# EAGLE design Mini Black Pill grblHAL v1 (EAGLE 9.6.2)
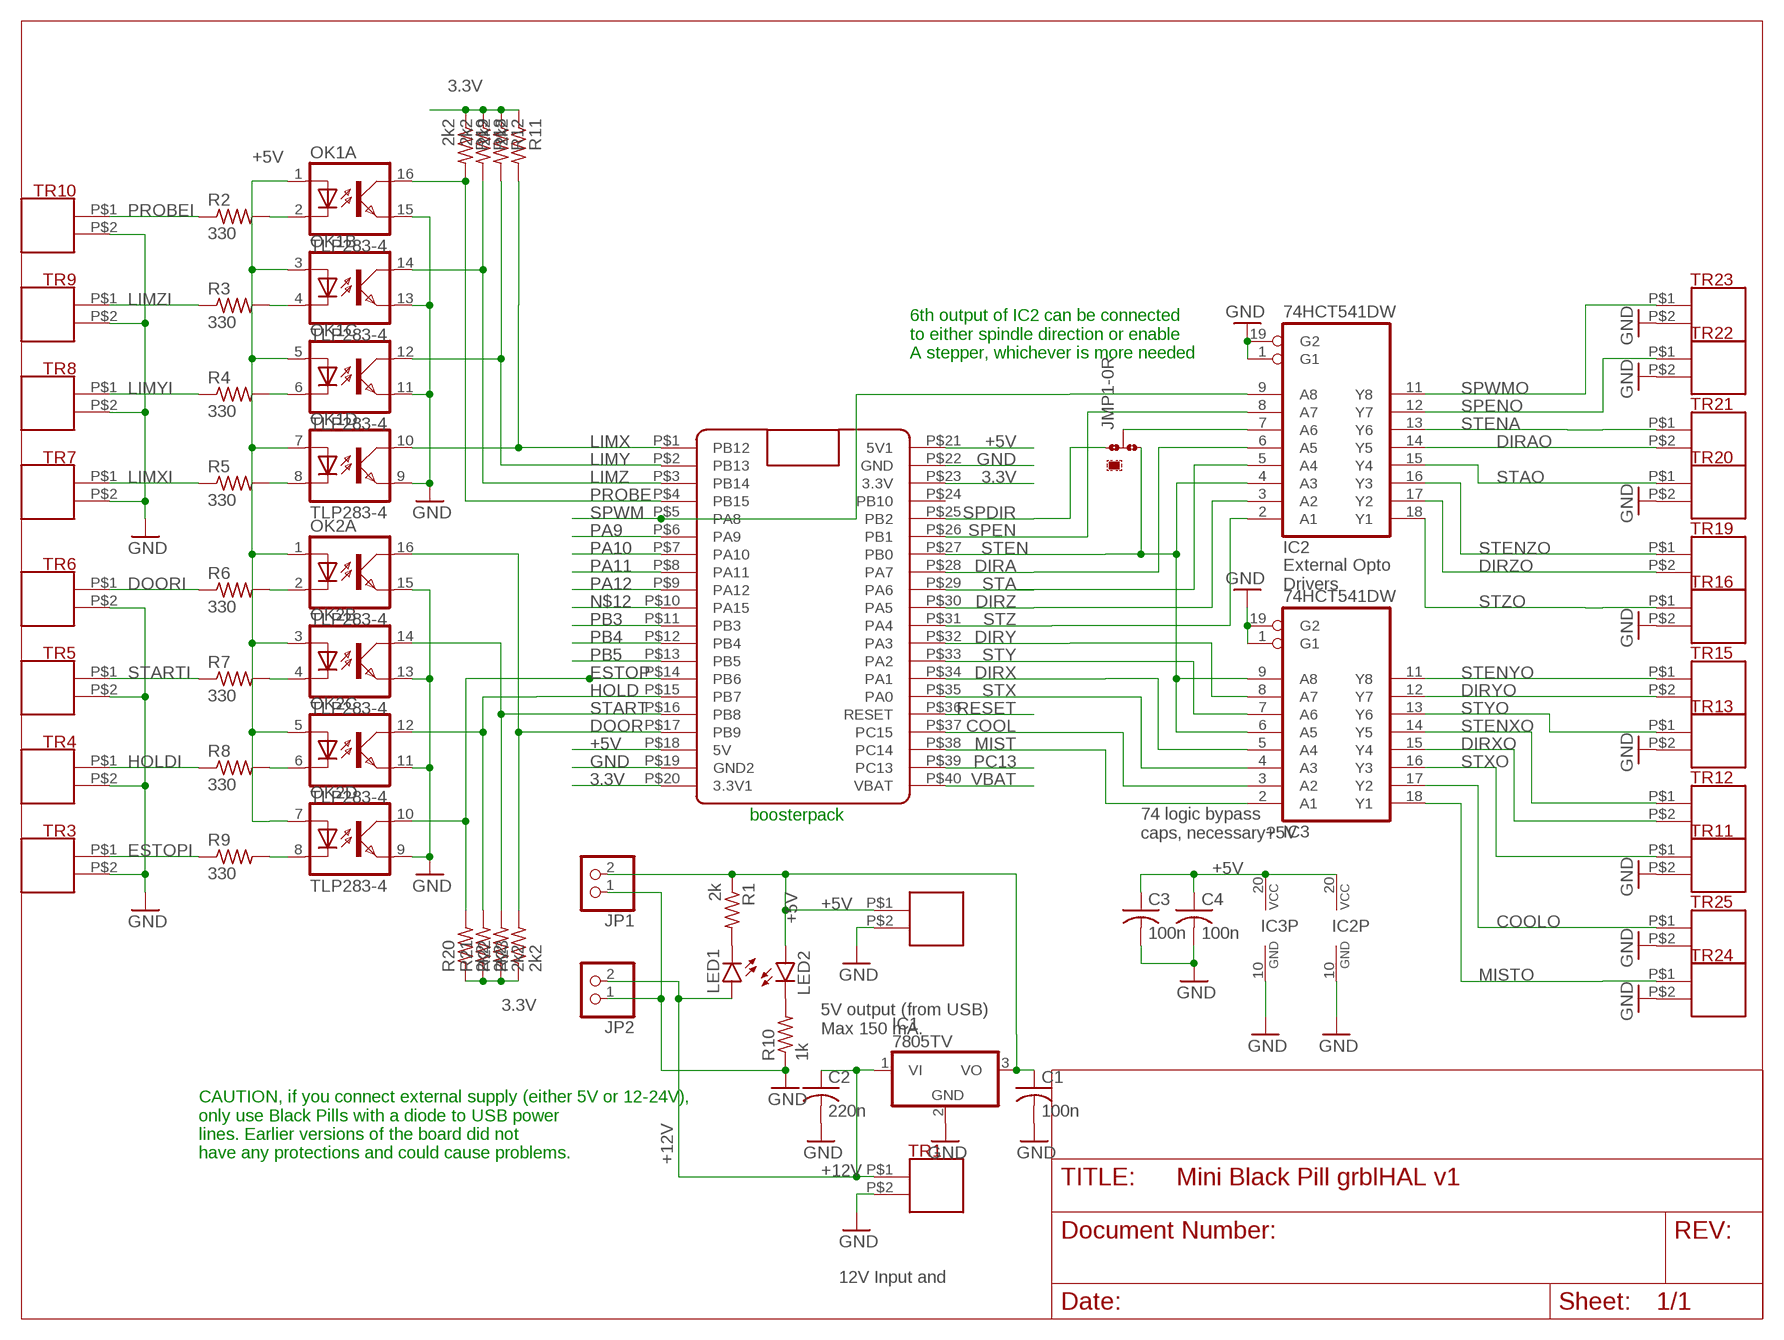
[diagram p0: schematic, sheet 1]

## Parts
C1  100n  C-USC0805  [C0805]
C2  220n  C-USC0805  [C0805]
C3  100n  C-USC0805  [C0805]
C4  100n  C-USC0805  [C0805]
IC1  7805TV  [TO220V]
IC2  74HCT541DW  [SO20W]
IC3  74HCT541DW  [SO20W]
JMP1  0R-JUMPA  [A0R-JMP]
JP1  PINHD-1X2  [1X02]
JP2  PINHD-1X2  [1X02]
LED1  LED3MM  [LED3MM]
LED2  LED3MM  [LED3MM]
OK1  TLP283-4  [MINI-FLAT-16]
OK2  TLP283-4  [MINI-FLAT-16]
R1  2k  R-US_R0805  [R0805]
R2  330  R-US_R0805  [R0805]
R3  330  R-US_R0805  [R0805]
R4  330  R-US_R0805  [R0805]
R5  330  R-US_R0805  [R0805]
R6  330  R-US_R0805  [R0805]
R7  330  R-US_R0805  [R0805]
R8  330  R-US_R0805  [R0805]
R9  330  R-US_R0805  [R0805]
R10  1k  R-US_R0805  [R0805]
R11  2k2  R-US_R0805  [R0805]
R12  2k2  R-US_R0805  [R0805]
R18  2k2  R-US_R0805  [R0805]
R19  2k2  R-US_R0805  [R0805]
R20  2k2  R-US_R0805  [R0805]
R21  2k2  R-US_R0805  [R0805]
R22  2k2  R-US_R0805  [R0805]
R23  2k2  R-US_R0805  [R0805]
TR1  T35-2  [T35-2]
TR2  T35-2  [T35-2]
TR3  T35-2  [T35-2]
TR4  T35-2  [T35-2]
TR5  T35-2  [T35-2]
TR6  T35-2  [T35-2]
TR7  T35-2  [T35-2]
TR8  T35-2  [T35-2]
TR9  T35-2  [T35-2]
TR10  T35-2  [T35-2]
TR11  T35-2  [T35-2]
TR12  T35-2  [T35-2]
TR13  T35-2  [T35-2]
TR15  T35-2  [T35-2]
TR16  T35-2  [T35-2]
TR19  T35-2  [T35-2]
TR20  T35-2  [T35-2]
TR21  T35-2  [T35-2]
TR22  T35-2  [T35-2]
TR23  T35-2  [T35-2]
TR24  T35-2  [T35-2]
TR25  T35-2  [T35-2]
U$2  BLACK_PILL  [BLUE_PILL]

## Nets
3.3V: R11.1 R12.1 R18.1 R19.1 R20.1 R21.1 R22.1 R23.1 U$2.P$20(3.3V1) U$2.P$23(3.3V)
+5V: C1.1 C3.1 C4.1 IC1.3(VO) IC2.20(VCC) IC3.20(VCC) JP1.2 LED2.A OK1.1(A:A) OK1.3(B:A) OK1.5(C:A) OK1.7(D:A) OK2.1(A:A) OK2.3(B:A) OK2.5(C:A) OK2.7(D:A) R1.1 TR2.P$1 U$2.P$18(5V) U$2.P$21(5V1)
+12V: C2.1 IC1.1(VI) JP2.2 LED1.A TR1.P$1
COOL: IC3.3(A2) U$2.P$37(PC15)
COOLO: IC3.17(Y2) TR25.P$1
DIRA: IC2.6(A5) U$2.P$28(PA7)
DIRAO: IC2.14(Y5) TR21.P$2
DIRX: IC3.5(A4) U$2.P$34(PA1)
DIRXO: IC3.15(Y4) TR12.P$2
DIRY: IC3.8(A7) U$2.P$32(PA3)
DIRYO: IC3.12(Y7) TR15.P$2
DIRZ: IC2.3(A2) U$2.P$30(PA5)
DIRZO: IC2.17(Y2) TR19.P$2
DOOR: OK2.16(A:COL) R23.2 U$2.P$17(PB9)
DOORI: R6.1 TR6.P$1
ESTOP: OK2.10(D:COL) R20.2 U$2.P$14(PB6)
ESTOPI: R9.1 TR3.P$1
GND: C1.2 C2.2 C3.2 C4.2 IC1.2(GND) IC2.1(G1) IC2.10(GND) IC2.19(G2) IC3.1(G1) IC3.10(GND) IC3.19(G2) JP1.1 JP2.1 OK1.9(D:EMIT) OK1.11(C:EMIT) OK1.13(B:EMIT) OK1.15(A:EMIT) OK2.9(D:EMIT) OK2.11(C:EMIT) OK2.13(B:EMIT) OK2.15(A:EMIT) R10.1 TR1.P$2 TR2.P$2 TR3.P$2 TR4.P$2 TR5.P$2 TR6.P$2 TR7.P$2 TR8.P$2 TR9.P$2 TR10.P$2 TR11.P$2 TR13.P$2 TR16.P$2 TR20.P$2 TR22.P$2 TR23.P$2 TR24.P$2 TR25.P$2 U$2.P$19(GND2) U$2.P$22(GND)
HOLD: OK2.12(C:COL) R21.2 U$2.P$15(PB7)
HOLDI: R8.1 TR4.P$1
LIMX: OK1.10(D:COL) R11.2 U$2.P$1(PB12)
LIMXI: R5.1 TR7.P$1
LIMY: OK1.12(C:COL) R12.2 U$2.P$2(PB13)
LIMYI: R4.1 TR8.P$1
LIMZ: OK1.14(B:COL) R18.2 U$2.P$3(PB14)
LIMZI: R3.1 TR9.P$1
MIST: IC3.2(A1) U$2.P$38(PC14)
MISTO: IC3.18(Y1) TR24.P$1
N$1: OK2.2(A:C) R6.2
N$2: LED2.K(C) R10.2
N$3: OK2.4(B:C) R7.2
N$4: LED1.K(C) R1.2
N$5: OK2.6(C:C) R8.2
N$6: OK1.8(D:C) R5.2
N$7: OK1.6(C:C) R4.2
N$8: OK1.4(B:C) R3.2
N$9: OK1.2(A:C) R2.2
N$10: OK2.8(D:C) R9.2
N$12: U$2.P$10(PA15)
N$13: IC2.7(A6) JMP1.2
PA9: U$2.P$6(PA9)
PA10: U$2.P$7(PA10)
PA11: U$2.P$8(PA11)
PA12: U$2.P$9(PA12)
PB3: U$2.P$11(PB3)
PB4: U$2.P$12(PB4)
PB5: U$2.P$13(PB5)
PC13: U$2.P$39(PC13)
PROBE: OK1.16(A:COL) R19.2 U$2.P$4(PB15)
PROBEI: R2.1 TR10.P$1
RESET: U$2.P$36(RESET)
SPDIR: JMP1.1 U$2.P$25(PB2)
SPEN: IC2.8(A7) U$2.P$26(PB1)
SPENO: IC2.12(Y7) TR22.P$1
SPWM: IC2.9(A8) U$2.P$5(PA8)
SPWMO: IC2.11(Y8) TR23.P$1
STA: IC2.5(A4) U$2.P$29(PA6)
STAO: IC2.15(Y4) TR20.P$1
START: OK2.14(B:COL) R22.2 U$2.P$16(PB8)
STARTI: R7.1 TR5.P$1
STEN: IC2.4(A3) IC3.6(A5) IC3.9(A8) JMP1.3 U$2.P$27(PB0)
STENA: IC2.13(Y6) TR21.P$1
STENXO: IC3.14(Y5) TR12.P$1
STENYO: IC3.11(Y8) TR15.P$1
STENZO: IC2.16(Y3) TR19.P$1
STX: IC3.4(A3) U$2.P$35(PA0)
STXO: IC3.16(Y3) TR11.P$1
STY: IC3.7(A6) U$2.P$33(PA2)
STYO: IC3.13(Y6) TR13.P$1
STZ: IC2.2(A1) U$2.P$31(PA4)
STZO: IC2.18(Y1) TR16.P$1
VBAT: U$2.P$40(VBAT)
Unconnected: U$2.P$24(PB10)

## Notes on the sheet
- 6th output of IC2 can be connected
  to either spindle direction or enable
  A stepper, whichever is more needed
- External Opto
  Drivers
- boosterpack
- 74 logic bypass
  caps, necessary?
- 5V output (from USB)
  Max 150 mA.
- CAUTION, if you connect external supply (either 5V or 12-24V),
  only use Black Pills with a diode to USB power
  lines. Earlier versions of the board did not
  have any protections and could cause problems.
- 12V Input and

## Library data of the parts
C1-C4 = rcl:C-US: CAPACITOR, American symbol; SPICEPREFIX: C
IC1 = linear:78*: Positive VOLTAGE REGULATOR Source: http://cache.national.com/ds/LM/LM78L05.pdf http://www.fairchildsemi.com/ds/LM/LM7805.pdf
IC2 IC3 = 74xx-eu:74*541: Octal BUFFER and LINE DRIVER, 3-state
JMP1 = jump-0r-smd:0R-JUMP: SMD 0R 0805 Jumper
JP1 JP2 = pinhead:PINHD-1X2: PIN HEADER
LED1 LED2 = led:LED: LED OSRAM: - CHIPLED LG R971, LG N971, LY N971, LG Q971, LY Q971, LO R971, LY R971 LH N974, LH R974 LS Q976, LO Q976, LY Q976 LO Q996 - Hyper CHIPLED LW Q18S LB Q993, LB Q99A, LB R99A - SideLED LS A670, LO A670, LY A670, LG A670, LP A670 LB A673, LV A673, LT A673, LW A673 LH A674 LY A675 LS A676, LA A676, LO A676, LY A676, LW A676 LS A679, LY A679, LG A679 - Hyper Micro SIDELED® LS Y876, LA Y876, LO Y876, LY Y876 LT Y87S - SmartLED LW L88C, LW L88S LB L89C, LB L89S, LG L890 LS L89K, LO L89K, LY L89K LS L896, LA L896, LO L896, LY L896 - TOPLED LS T670, LO T670, LY T670, LG T670, LP T670 LSG T670, LSP T670, LSY T670, LOP T670, LYG T670 LG T671, LOG T671, LSG T671 LB T673, LV T673, LT T673, LW T673 LH T674 LS T676, LA T676, LO T676, LY T676, LB T676, LH T676, LSB T676, LW T676 LB T67C, LV T67C, LT T67C, LS T67K, LO T67K, LY T67K, LW E67C LS E67B, LA E67B, LO E67B, LY E67B, LB E67C, LV E67C, LT E67C LW T67C LS T679, LY T679, LG T679 LS T770, LO T770, LY T770, LG T770, LP T770 LB T773, LV T773, LT T773, LW T773 LH T774 LS E675, LA E675, LY E675, LS T675 LS T776, LA T776, LO T776, LY T776, LB T776 LHGB T686 LT T68C, LB T68C - Hyper Mini TOPLED® LB M676 - Mini TOPLED Santana® LG M470 LS M47K, LO M47K, LY M47K Source: http://www.osram.convergy.de LUXEON: - LUMILED® LXK2-PW12-R00, LXK2-PW12-S00, LXK2-PW14-U00, LXK2-PW14-V00 LXK2-PM12-R00, LXK2-PM12-S00, LXK2-PM14-U00 LXK2-PE12-Q00, LXK2-PE12-R00, LXK2-PE12-S00, LXK2-PE14-T00, LXK2-PE14-U00 LXK2-PB12-K00, LXK2-PB12-L00, LXK2-PB12-M00, LXK2-PB14-N00, LXK2-PB14-P00, LXK2-PB14-Q00 LXK2-PR12-L00, LXK2-PR12-M00, LXK2-PR14-Q00, LXK2-PR14-R00 LXK2-PD12-Q00, LXK2-PD12-R00, LXK2-PD12-S00 LXK2-PH12-R00, LXK2-PH12-S00 LXK2-PL12-P00, LXK2-PL12-Q00, LXK2-PL12-R00 Source: www.luxeon.com KINGBRIGHT: KA-3528ASYC Source: www.kingbright.com
OK1 OK2 = optocoupler-3-jcn:TLP283-4: TOSHIBA PHOTOCOUPLER GaAs IRED & PHOTO-TRANSISTOR Source: http://www.semicon.toshiba.co.jp/td/en/Opto/Photocoupler/en_20050928_TLP283_datasheet.pdf
R1-R12 R18-R23 = rcl:R-US_: RESISTOR, American symbol; SPICEPREFIX: R
TR1-TR13 TR15 TR16 TR19-TR25 = BP shield_soic:T35-2
U$2 = Black pill STM32:BLACK_PILL

## Board
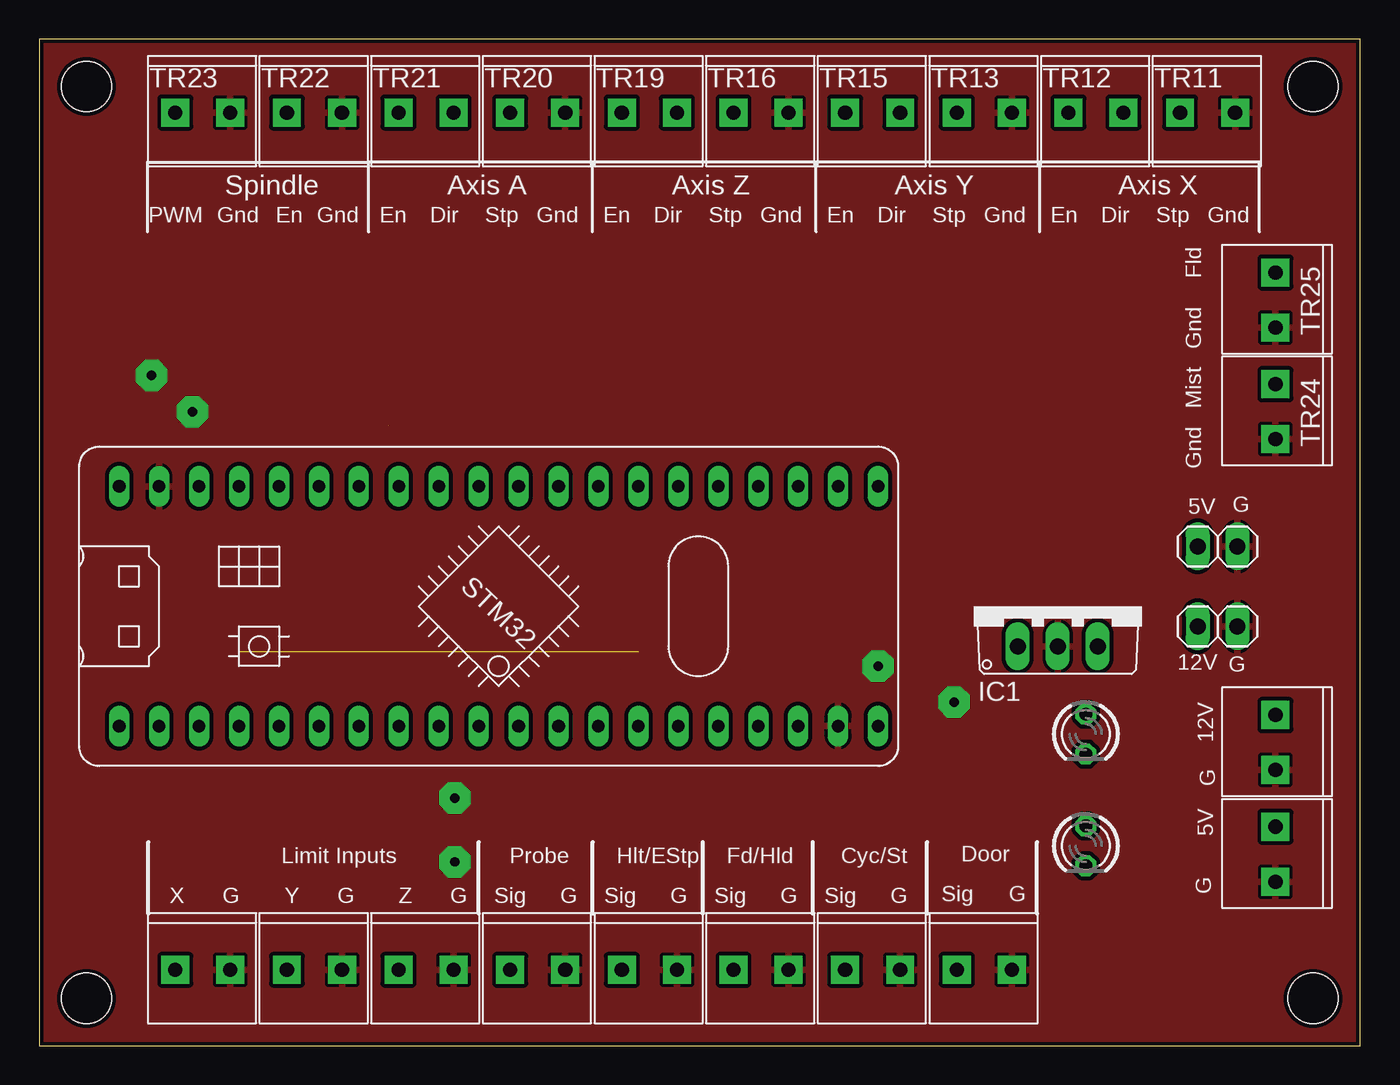
[diagram p1: board, top side]
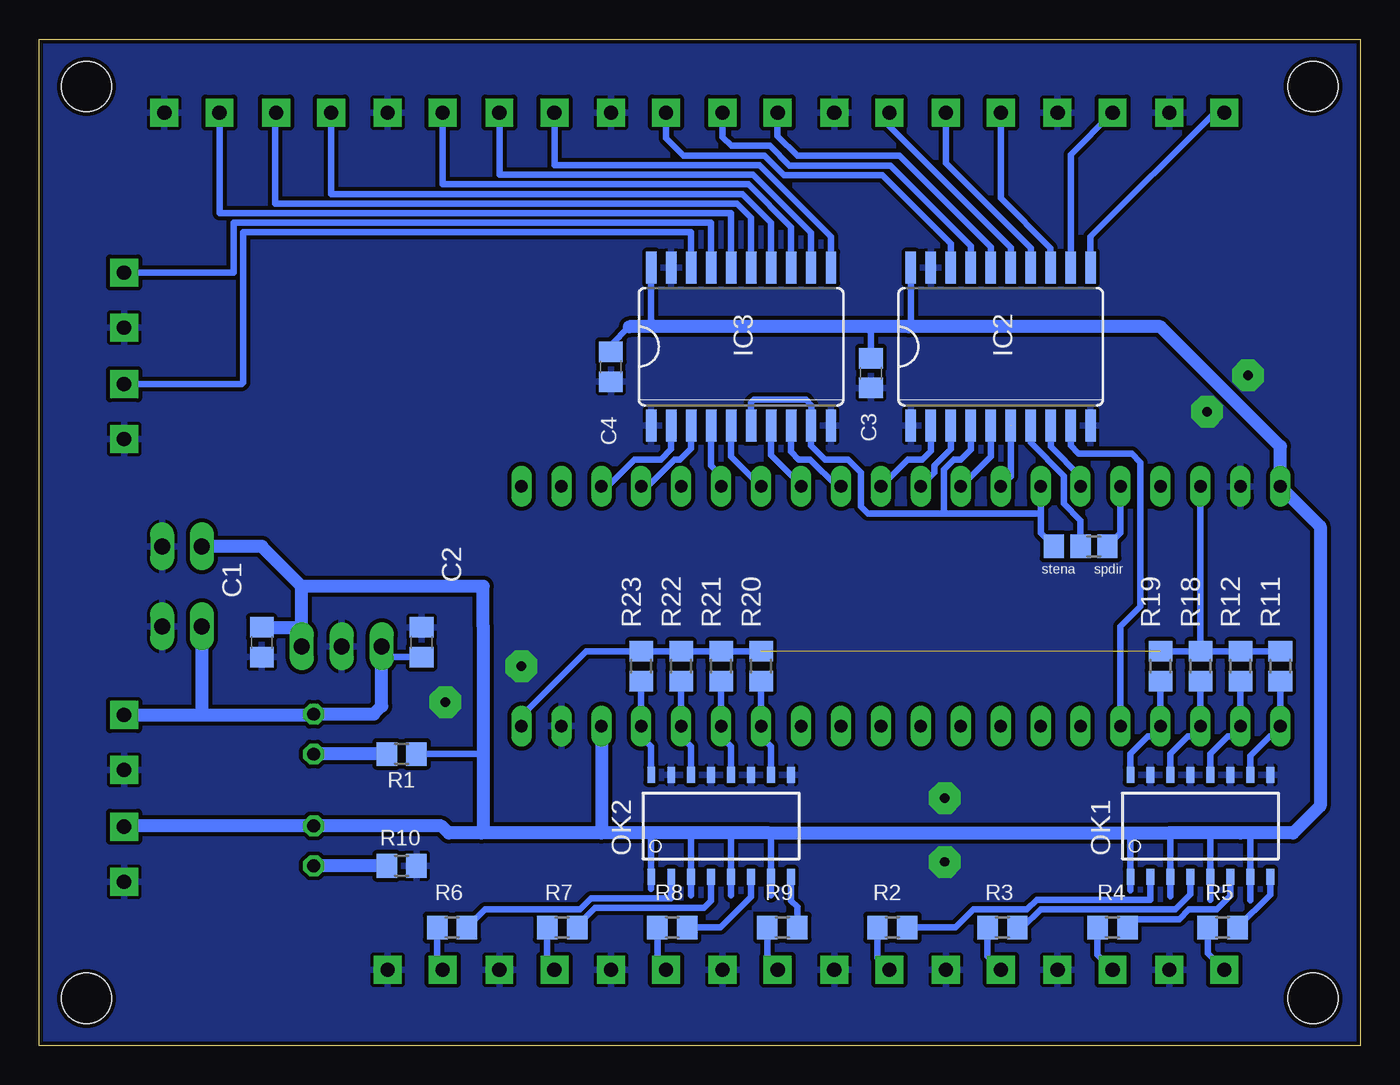
[diagram p2: board, bottom side, seen from below]

Size 84 x 64 mm. Coordinates in mm from the lower left corner, seen from the top.
Outline: 0,0 84,0 84,64 0,64 0,0
Copper layers (1*16): Top 0.035mm / dielectric 1.5mm / Bottom 0.035mm
Design rules "default *": minimum track width 10mil, minimum drill 24mil, track to track 0.2mm, track to pad 0.2mm, pad to pad 0.2mm, via to via 0.2mm, smd to smd 0.2mm, copper to edge 1mil, drill to drill 8mil, minimum pad ring 10mil, minimum via ring 8mil, stop-mask expansion 4mil, vias tented up to drill 0mil, thermal gap 0.2mm
Holes 3.2 mm at 3,61 3,3 81,3 81,61

### Footprints (pad centres in the part's own frame; a part is rotated, then mirrored left to right if it is on the bottom)
C0805 = smd 1.3 x 1.5: 1 -0.95,0; 2 0.95,0
TO220V = drill 1.016 long: 1 -2.54,-2.54; 2 0,-2.54; 3 2.54,-2.54
SO20W = smd 0.66 x 2.032: 1 -5.715,-5.029; 2 -4.445,-5.029; 3 -3.175,-5.029; 4 -1.905,-5.029; 5 -0.635,-5.029; 6 0.635,-5.029; 7 1.905,-5.029; 8 3.175,-5.029; 9 4.445,-5.029; 10 5.715,-5.029; 11 5.715,5.029; 12 4.445,5.029; 13 3.175,5.029; 14 1.905,5.029; 15 0.635,5.029; 16 -0.635,5.029; 17 -1.905,5.029; 18 -3.175,5.029; 19 -4.445,5.029; 20 -5.715,5.029
A0R-JMP = smd 1.5 x 1.3: 1 0,1.7; 2 0,0; 3 0,-1.7
1X02 = drill 1.016 long: 1 -1.27,0; 2 1.27,0
LED3MM = drill 0.813 octagon: A -1.27,0; K 1.27,0
MINI-FLAT-16 = smd 1 x 0.5: 1 -3.24,4.445; 2 -3.24,3.175; 3 -3.24,1.905; 4 -3.24,0.635; 5 -3.24,-0.635; 6 -3.24,-1.905; 7 -3.24,-3.175; 8 -3.24,-4.445; 9 3.24,-4.445; 10 3.24,-3.175; 11 3.24,-1.905; 12 3.24,-0.635; 13 3.24,0.635; 14 3.24,1.905; 15 3.24,3.175; 16 3.24,4.445
R0805 = smd 1.3 x 1.5: 1 -0.95,0; 2 0.95,0
T35-2 = drill 0.9 pad 1.778 square: P$1 1.75,0; P$2 -1.75,0
BLUE_PILL = drill 0.8 long: P$1 -7.62,15.24; P$2 -7.62,12.7; P$3 -7.62,10.16; P$4 -7.62,7.62; P$5 -7.62,5.08; P$6 -7.62,2.54; P$7 -7.62,0; P$8 -7.62,-2.54; P$9 -7.62,-5.08; P$10 -7.62,-7.62; P$11 -7.62,-10.16; P$12 -7.62,-12.7; P$13 -7.62,-15.24; P$14 -7.62,-17.78; P$15 -7.62,-20.32; P$16 -7.62,-22.86; P$17 -7.62,-25.4; P$18 -7.62,-27.94; P$19 -7.62,-30.48; P$20 -7.62,-33.02; P$21 7.62,15.24; P$22 7.62,12.7; P$23 7.62,10.16; P$24 7.62,7.62; P$25 7.62,5.08; P$26 7.62,2.54; P$27 7.62,0; P$28 7.62,-2.54; P$29 7.62,-5.08; P$30 7.62,-7.62; P$31 7.62,-10.16; P$32 7.62,-12.7; P$33 7.62,-15.24; P$34 7.62,-17.78; P$35 7.62,-20.32; P$36 7.62,-22.86; P$37 7.62,-25.4; P$38 7.62,-27.94; P$39 7.62,-30.48; P$40 7.62,-33.02

### Placement (x,y rotation side)
C1  69.85,25.65 270 bottom
C2  59.69,25.65 90 bottom
C3  31.11,42.77 270 bottom
C4  47.65,43.18 270 bottom
IC1  64.77,27.94 0 top
IC2  22.86,44.45 0 bottom
IC3  39.37,44.45 0 bottom
JMP1  17.78,31.75 270 bottom
JP1  74.93,31.75 180 top
JP2  74.93,26.67 180 top
LED1  66.55,19.81 270 top
LED2  66.55,12.7 270 top
OK1  10.16,13.97 90 bottom
OK2  40.64,13.97 90 bottom
R1  60.96,18.54 180 bottom
R2  29.75,7.51 0 bottom
R3  22.75,7.51 0 bottom
R4  15.75,7.51 0 bottom
R5  8.75,7.51 0 bottom
R6  57.75,7.51 0 bottom
R7  50.75,7.51 0 bottom
R8  43.75,7.51 0 bottom
R9  36.75,7.51 0 bottom
R10  60.96,11.43 180 bottom
R11  5.08,24.13 270 bottom
R12  7.62,24.13 270 bottom
R18  10.16,24.13 270 bottom
R19  12.7,24.13 270 bottom
R20  38.1,24.13 270 bottom
R21  40.64,24.13 270 bottom
R22  43.18,24.13 270 bottom
R23  45.72,24.13 270 bottom
TR1  78.61,19.27 90 top
TR2  78.61,12.17 90 top
TR3  38.8,4.82 180 top
TR4  45.9,4.82 180 top
TR5  53,4.82 180 top
TR6  60.1,4.82 180 top
TR7  10.4,4.82 180 top
TR8  17.5,4.82 180 top
TR9  24.6,4.82 180 top
TR10  31.7,4.82 180 top
TR11  74.3,59.33 180 top
TR12  67.2,59.33 180 top
TR13  60.1,59.33 180 top
TR15  53,59.33 180 top
TR16  45.9,59.33 180 top
TR19  38.8,59.33 180 top
TR20  31.7,59.33 180 top
TR21  24.6,59.33 180 top
TR22  17.5,59.33 180 top
TR23  10.4,59.33 180 top
TR24  78.61,40.32 90 top
TR25  78.61,47.42 90 top
U$2  20.32,27.94 90 top

### Tracks (layer width: path | path; a pad name or v marks a point on that pad's centre or on a via)
3.3V  (1 unrouted)
  Bottom 0.406: U$2.P$20 53.34,20.97 49.23,25.08 R23.1 R22.1 R21.1 R20.1 | R11.1 R12.1 R18.1 | U$2.P$23 R18.1 | R19.1 R18.1
+5V
  Bottom 0.406: 9.65,13.52 9.53,13.52 OK1.5 9.53,9.27 | 12.19,13.52 12.06,13.52 OK1.3 12.06,9.5 | 37.59,13.52 37.47,13.52 OK2.7 37.47,9.55 | 40.13,13.52 40.01,13.52 OK2.5 40.01,9.55 | 42.67,13.52 42.55,13.52 OK2.3 42.55,9.55 | 45.21,13.52 45.09,13.52 OK2.1 45.09,9.98 | IC2.20 28.57,45.85 28.7,45.72 | 31.27,45.72 31.11,45.57 C3.1 | 47.46,44.13 C4.1 47.65,44.55 46.48,45.72 | 14.73,13.52 14.61,13.52 OK1.1 14.61,9.88 | 7.11,13.52 6.99,13.39 OK1.7 6.99,9.25 | 45.09,45.85 IC3.20 | R1.1 55.93,18.54 55.78,18.39 | 5.21,35.56 U$2.P$21 5.21,35.56
  Bottom 0.813: 67.31,29.21 IC1.3 67.32,26.6 C1.1 | JP1.2 69.85,31.75 67.31,29.21 | 67.31,29.21 55.78,29.21 55.78,26.67 55.78,18.39 55.78,13.62 55.88,13.52 | TR2.P$1 78.57,13.97 LED2.A 58.42,13.97 57.97,13.52 55.88,13.52 | 44.96,45.72 31.27,45.72 28.7,45.72 12.7,45.72 5.08,38.1 U$2.P$21 2.54,33.02 2.54,15.24 4.26,13.52 7.11,13.52 7.62,13.52 9.65,13.52 12.19,13.52 13.97,13.52 14.73,13.52 37.59,13.52 40.13,13.52 42.67,13.52 45.21,13.52 48.26,13.52 | 45.09,45.85 44.96,45.72 | 44.96,45.72 46.48,45.72 | 48.26,13.52 55.88,13.52 | U$2.P$18 48.26,13.52
+12V
  Bottom 0.406: C2.1 61.53,24.7 IC1.1
  Bottom 0.813: TR1.P$1 73.66,21.02 | 73.66,21.02 66.61,21.02 LED1.A 62.74,21.08 62.23,21.59 IC1.1 | JP2.2 73.66,21.02
COOL
  Bottom 0.406: IC3.3 42.55,37.97 43.25,37.27 43.62,37.27 45.33,35.56 U$2.P$37
COOLO
  Bottom 0.406: IC3.17 41.27,52.35 71.63,52.35 71.63,49.53 71.63,49.17 TR25.P$1
DIRA  (1 unrouted)
  Bottom 0.406: U$2.P$28 22.23,36.2 IC2.6
DIRAO
  Bottom 0.406: IC2.14 20.95,50.72 26.35,56.12 TR21.P$2
DIRX
  Bottom 0.406: IC3.5 40.01,37.47 U$2.P$34
DIRXO
  Bottom 0.406: TR12.P$2 69.01,59.27 69.01,53.56 39.64,53.56 38.73,52.65 IC3.15
DIRY
  Bottom 0.406: IC3.8 36.2,37.77 35.71,37.29 34.98,37.29 33.25,35.56 U$2.P$32
DIRYO
  Bottom 0.406: IC3.12 34.92,51.7 38.6,55.38 54.75,55.38 TR15.P$2
DIRZ
  Bottom 0.406: U$2.P$30 27.06,36.44 27.06,36.9 26.04,37.93 IC2.3
DIRZO
  Bottom 0.406: IC2.17 24.76,49.49 24.76,50.85 29.88,55.98 36.3,55.98 37.54,57.23 39.99,57.23 40.55,57.78 TR19.P$2
DOOR
  Bottom 0.406: R23.2 U$2.P$17 45.72,19.67 45.09,19.03 OK2.16
DOORI
  Bottom 0.406: R6.1 58.7,5.17 TR6.P$1
ESTOP
  Bottom 0.406: R20.2 U$2.P$14 38.1,19.67 37.47,19.03 OK2.10
ESTOPI
  Bottom 0.406: R9.1 37.7,5.47 TR3.P$1
GND  (via drill 0.6 pad 2)
  other vias: 58.17,21.84 53.34,24.13 26.42,15.75 26.42,11.68 9.73,40.31 7.14,42.62
  pour Bottom (isolate 0.254): 0,0 83.82,0 83.82,63.82 0,63.82
  pour Top (isolate 0.254): 0,-1.27 87.63,-1.27 87.63,66.36 0,66.36
HOLD
  Bottom 0.406: R21.2 U$2.P$15 40.64,19.67 40.01,19.03 OK2.12
HOLDI
  Bottom 0.406: R8.1 44.7,5.37 TR4.P$1
LIMX
  Bottom 0.406: R11.2 5.08,20.97 U$2.P$1 5.08,19.67 5.73,19.67 6.99,18.41 OK1.10
LIMXI
  Bottom 0.406: R5.1 9.7,5.87 TR7.P$1
LIMY
  Bottom 0.406: OK1.12 9.53,18.55 8.41,19.67 7.62,19.67 U$2.P$2 7.62,20.97 R12.2
LIMYI
  Bottom 0.406: R4.1 16.7,5.77 TR8.P$1
LIMZ
  Bottom 0.406: OK1.14 12.06,18.55 10.95,19.67 10.16,19.67 U$2.P$3 10.16,20.97 R18.2
LIMZI
  Bottom 0.406: R3.1 23.7,5.67 TR9.P$1
MIST
  Bottom 0.406: IC3.2 43.81,37.93 44.48,37.27 46.16,37.27 47.87,35.56 U$2.P$38
MISTO
  Bottom 0.406: IC3.18 42.55,51.74 71.02,51.74 71.02,42.17 71.12,42.07 TR24.P$1
N$1
  Bottom 0.406: 56.8,7.61 R6.2 55.65,8.66 49.6,8.66 48.91,9.36 43.83,9.36 43.81,9.37 OK2.2
N$2
  Bottom 0.813: R10.2 LED2.K
N$3
  Bottom 0.406: R7.2 49.8,7.61 48.66,8.75 41.73,8.75 41.27,9.21 OK2.4
N$4
  Bottom 0.813: R1.2 LED1.K
N$5
  Bottom 0.406: R8.2 40.69,7.51 38.73,9.46 OK2.6
N$6
  Bottom 0.406: R5.2 5.71,9.59 OK1.8
N$7
  Bottom 0.406: OK1.6 8.26,9.53 9.12,8.66 10.9,8.66 11.52,8.04 14.27,8.04 R4.2
N$8
  Bottom 0.406: R3.2 21.8,7.61 R3.2 | OK1.4 10.79,9.63 11.76,8.66 20.32,8.66 21.47,7.51 R3.2
N$9
  Bottom 0.406: R2.2 25.75,7.51 24.6,8.66 21.18,8.66 20.58,9.27 13.34,9.27 13.34,10.48 OK1.2
N$10
  Bottom 0.406: OK2.8 36.2,9.21 35.8,8.81 R9.2
N$13
  Bottom 0.406: JMP1.2 17.78,33.41 18.84,34.47 18.84,36.24 20.95,38.35 IC2.7
PROBE
  Bottom 0.406: OK1.16 14.61,18.55 13.49,19.67 12.7,19.67 U$2.P$4 12.7,20.97 R19.2
PROBEI
  Bottom 0.406: R2.1 30.7,5.57 TR10.P$1
SPDIR
  Bottom 0.406: JMP1.1 15.24,32.59 U$2.P$25
SPEN
  Bottom 0.406: U$2.P$26 17.78,36.2 19.68,38.1 IC2.8
SPENO
  Bottom 0.406: TR22.P$1 18.41,56.67 IC2.12
SPWM
  Bottom 0.406: U$2.P$5 15.24,26.67 13.97,27.94 13.97,37.08 14.53,37.64 17.91,37.64 18.41,38.15 IC2.9
SPWMO
  Bottom 0.406: TR23.P$1 9.25,59.33 17.14,51.44 IC2.11
STA
  Bottom 0.406: U$2.P$29 23.5,37.47 IC2.5
STAO
  Bottom 0.406: IC2.15 22.23,50.75 29.95,58.47 TR20.P$1
START
  Bottom 0.406: R22.2 U$2.P$16 43.18,19.67 42.55,19.03 OK2.14
STARTI
  Bottom 0.406: R7.1 51.7,5.27 TR5.P$1
STEN
  Bottom 0.406: JMP1.3 20.32,32.59 20.32,33.83 | 20.32,33.83 U$2.P$27 | IC2.4 24.77,37.91 25.4,37.27 25.84,37.27 26.46,36.65 26.46,33.86 26.47,33.85 | 20.32,33.83 20.34,33.85 25.84,33.85 26.47,33.85 | 26.47,33.85 31.31,33.85 31.75,34.29 31.75,36.44 32.58,37.27 34.03,37.27 34.92,38.17 IC3.9 34.9,39.45 34.9,40.72 35.26,41.07 38.56,41.07 38.73,40.89 IC3.6
STENA
  Bottom 0.406: IC2.13 19.7,49.49 19.7,50.72 22.86,53.88 TR21.P$1
STENXO
  Bottom 0.406: IC3.14 37.47,52.35 39.28,54.16 65.45,54.16 TR12.P$1
STENYO
  Bottom 0.406: TR15.P$1 51.25,56 51.23,55.98 38.2,55.98 33.66,51.44 IC3.11
STENZO
  Bottom 0.406: IC2.16 23.5,50.77 29.3,56.59 35.8,56.59 37.05,57.83 TR19.P$1
STX
  Bottom 0.406: IC3.4 41.27,36.88 40.64,36.25 U$2.P$35
STXO
  Bottom 0.406: TR11.P$1 72.55,52.95 40.01,52.95 IC3.16
STY
  Bottom 0.406: IC3.7 37.47,37.57 35.56,35.66 U$2.P$33
STYO
  Bottom 0.406: IC3.13 36.2,52.06 38.9,54.77 58.35,54.77 TR13.P$1
STZ
  Bottom 0.406: U$2.P$31 28.77,37.27 27.85,37.27 27.3,37.82 IC2.2
STZO
  Bottom 0.406: IC2.18 26.04,51 30.38,55.35 36.63,55.35 37.88,56.59 43.03,56.59 44.15,57.71 TR16.P$1

### Text on the board
tPlace: Spindle | Axis A | Axis Z | Axis Y | Axis X | PWM | Gnd | En | Gnd | En | Dir | Stp | Gnd | En | Dir | Stp | Gnd | En | Dir | Stp | Gnd | En | Dir | Stp | Gnd | Fld | Gnd | Mist | Gnd | 5V | G | 12V | G | 12V | G | Limit Inputs | Probe | Hlt/EStp | Fd/Hld | Cyc/St | Door | 5V | X | G | Y | G | Z | G | Sig | G | Sig | G | Sig | G | Sig | G | Sig | G | G
bPlace: spdir | stena